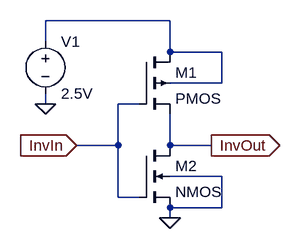
[diagram p0: schematic Draft1.asc]
Draft1.asc, the LTspice schematic file:
Version 4
SHEET 1 880 680
WIRE 224 16 32 16
WIRE 32 48 32 16
WIRE 224 64 224 16
WIRE 304 64 224 64
WIRE 304 112 304 64
WIRE 304 112 224 112
WIRE 32 144 32 128
WIRE 176 144 144 144
WIRE 144 208 144 144
WIRE 144 208 80 208
WIRE 224 208 224 160
WIRE 288 208 224 208
WIRE 304 256 224 256
WIRE 144 288 144 208
WIRE 176 288 144 288
WIRE 304 304 304 256
WIRE 304 304 224 304
WIRE 224 320 224 304
FLAG 32 144 0
FLAG 224 320 0
FLAG 80 208 InvIn
IOPIN 80 208 In
FLAG 288 208 InvOut
IOPIN 288 208 Out
SYMBOL pmos4 176 64 R0
SYMATTR InstName M1
SYMATTR Value2 l=0.24u w=1.5u
SYMBOL nmos4 176 208 R0
SYMATTR InstName M2
SYMATTR Value2 l=0.24u w=1u
SYMBOL voltage 32 32 R0
WINDOW 123 0 0 Left 2
WINDOW 39 0 0 Left 2
SYMATTR InstName V1
SYMATTR Value 2.5V

The netlist it stands for:
* Draft1.asc
M1 N001 InvIn InvOut N001 PMOS l=0.24u w=1.5u
M2 InvOut InvIn 0 0 NMOS l=0.24u w=1u
V1 N001 0 2.5V
.model NMOS NMOS
.model PMOS PMOS
.lib standard.mos
.backanno
.end